# EasyEDA Pro project 2025智能物流搬运_PCB_XAUT_20250927.eprj, schematic Schematic17
Board Name: 2.42寸OLED转接; Create Date: 2025-06-24; Page Name: P1; Project Name: 物流车底盘测试; Schematic Name: Schematic17; Update Date: 2025-06-24; Company: 嘉立创EDA; Page Size: A4; Version: V1.0
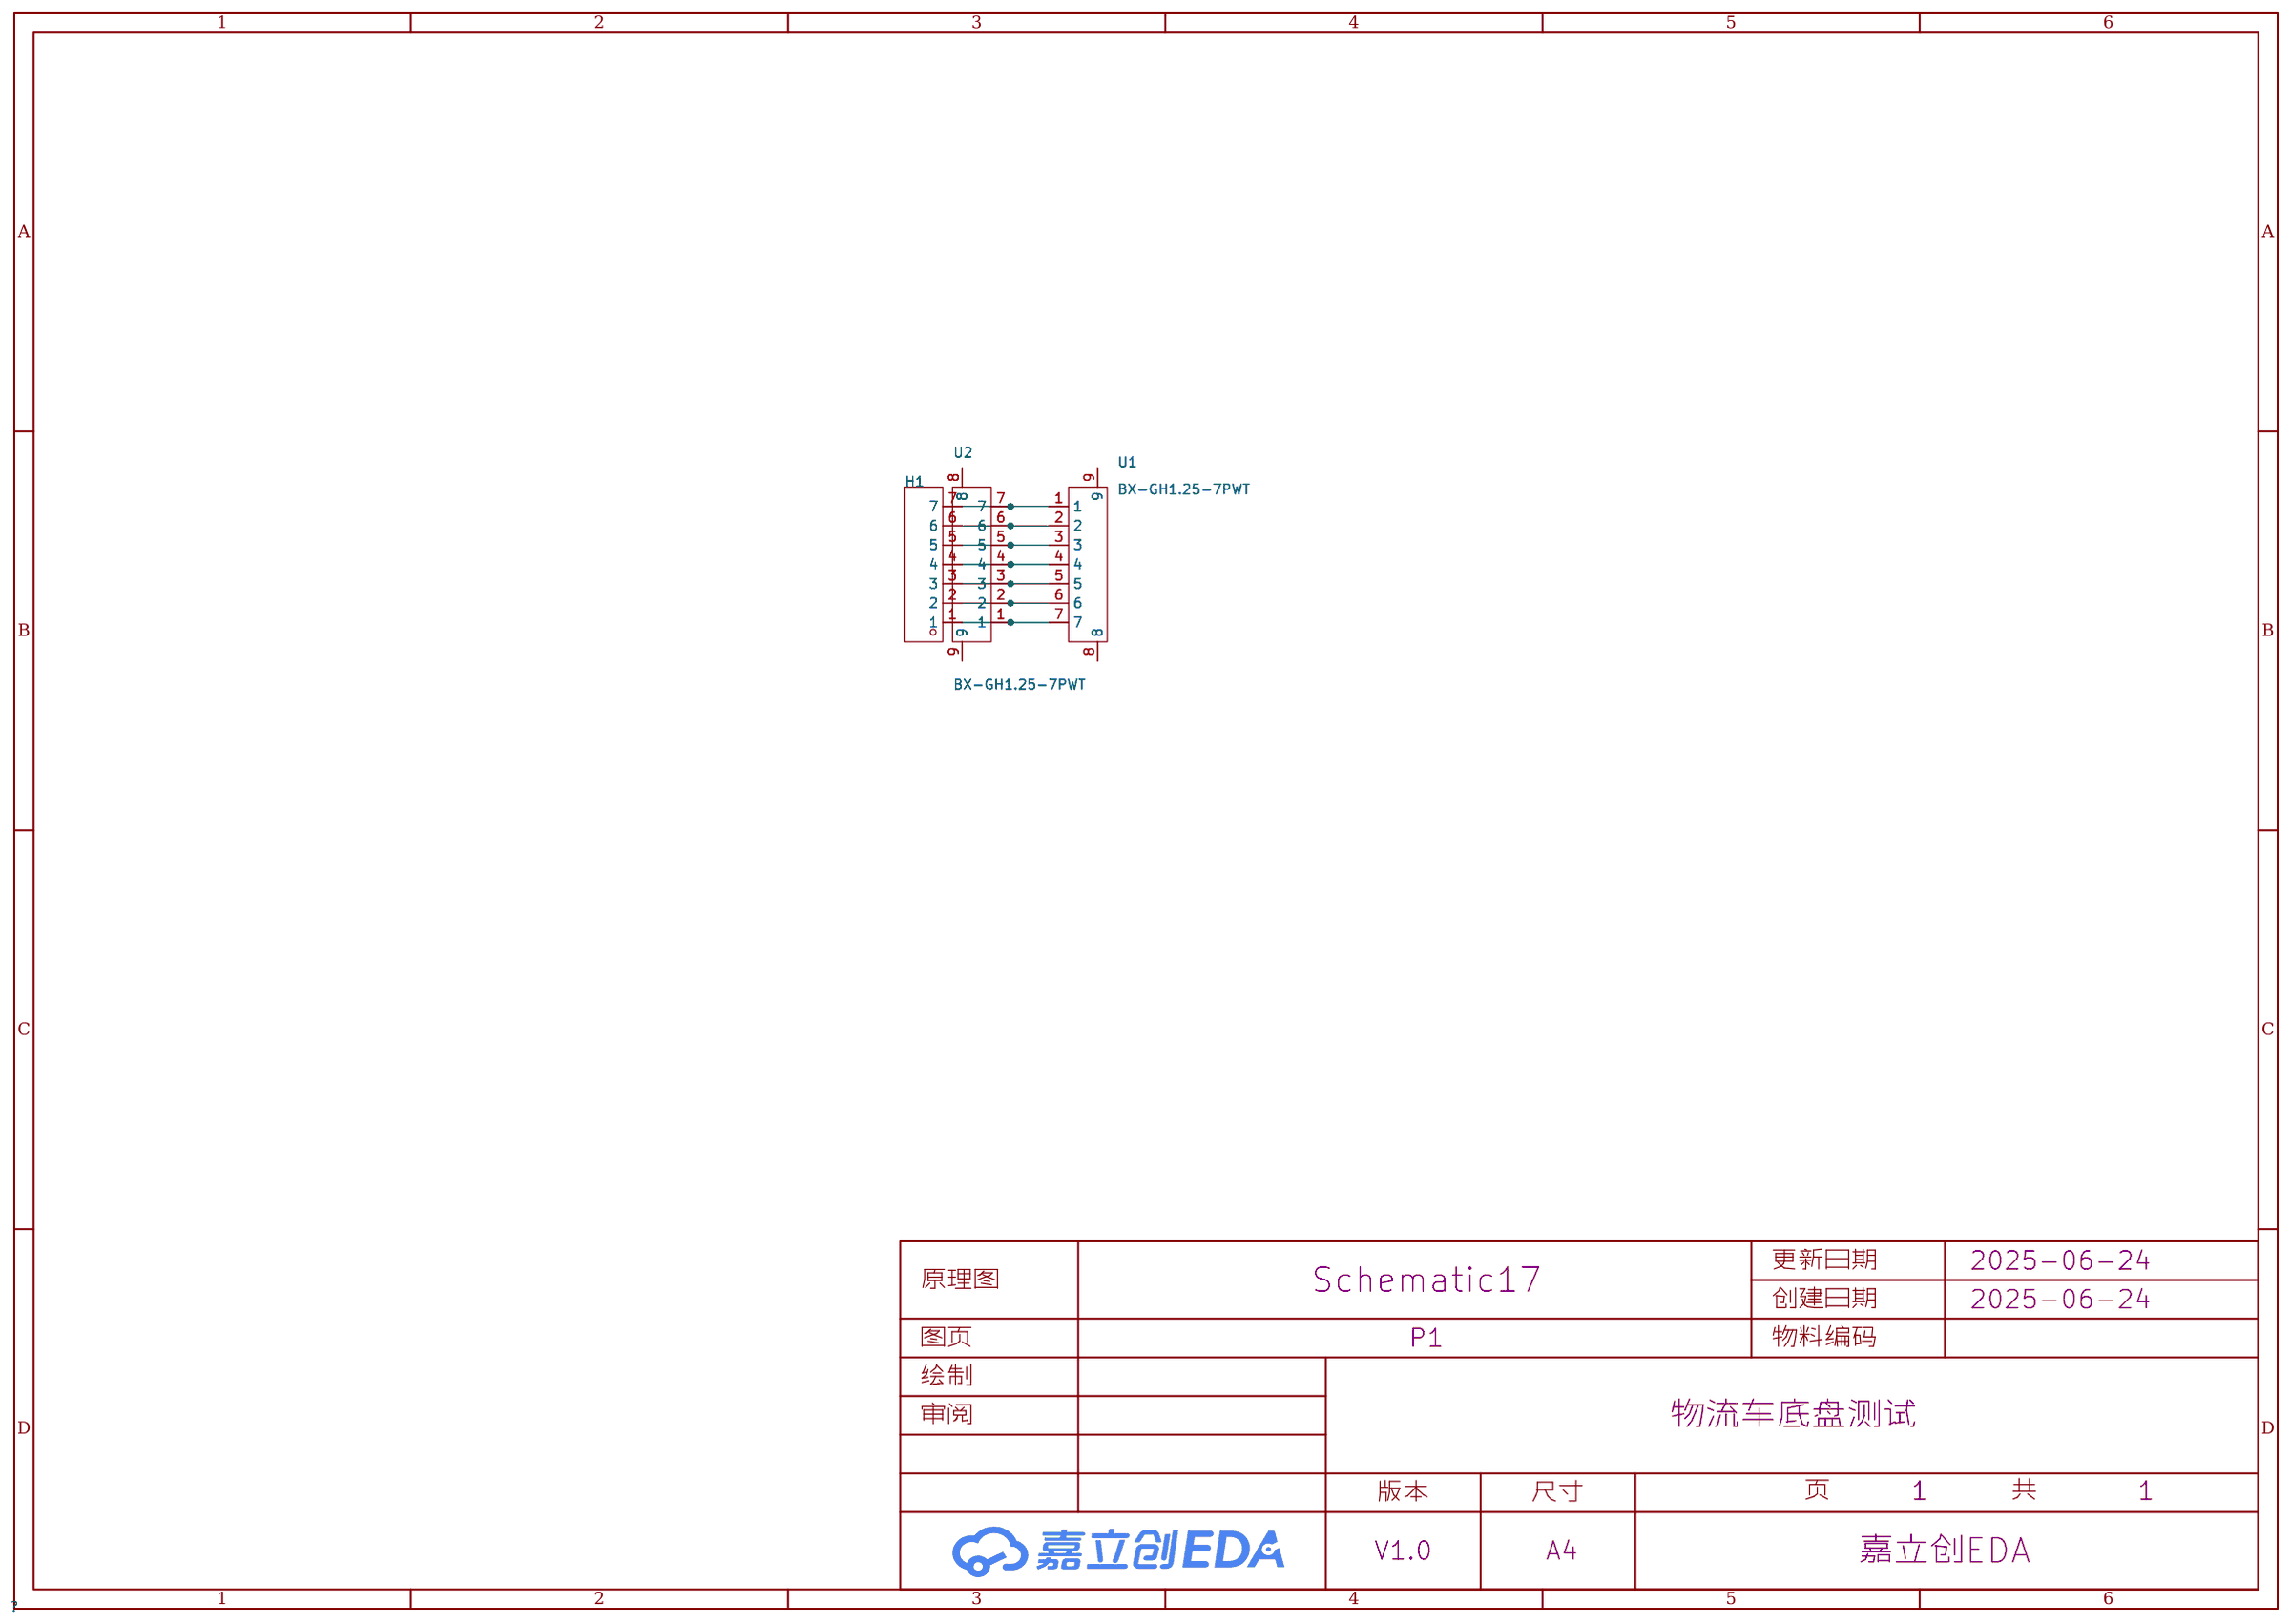
[diagram p2: schematic sheet]

## Parts
H1  -  [HDR-TH_7P-P2.54-V-M]
U1  BX-GH1.25-7PWT  [CONN-SMD_7P-P1.25_BX-GH1.25-7PWT]
U2  BX-GH1.25-7PWT  [CONN-SMD_7P-P1.25_BX-GH1.25-7PWT]

## Library data of the parts
H1 = HDR-M_2.54_1x7P: Supplier Part: C492406; Supplier Footprint: 插件
U1 U2 = BX-GH1.25-7PWT: LCSC Part Name: 1x7P 间距:1.25mm 卧贴 系列:GH; Supplier Part: C18077723; Manufacturer: Bossie(博锡); Supplier Footprint: SMD,P=1.25mm,卧贴; JLCPCB Part Class: 扩展库; Datasheet: https://atta.szlcsc.com/upload/public/pdf/source/20231017/E21872F9B85DEECEBF976C7E4F518E45.pdf; Supplier: LCSC; Pins Structure: 1x7P; Pitch: 1.25mm; Mounting Type: 卧贴; Reference Series: GH; Number of Pins: 7P; Number of Rows: 1; Number of PINs Per Row: 7; Current Rating: 1A; Contact Material: 磷铜; Contact Plating: 锡; Operating Temperature: -25℃~+85℃; Voltage Rating: 125V; Plastic Material: LCP; Supplementary Features: 辅助焊脚; Color: 米色; Z-Height of the Board: 4.35mm; X-Length of Bottom Edge on Board (Spacing Line): 12mm; Y-Width of Bottom Edge on Board: 5mm

## Nets
Net-(H1-1): H1.1 U1.7 U2.1
Net-(H1-2): H1.2 U1.6 U2.2
Net-(H1-3): H1.3 U1.5 U2.3
Net-(H1-4): H1.4 U1.4 U2.4
Net-(H1-5): H1.5 U1.3 U2.5
Net-(H1-6): H1.6 U1.2 U2.6
Net-(H1-7): H1.7 U1.1 U2.7

Not connected (* = marked no-connect by the designer): U1 8 9; U2 8 9
